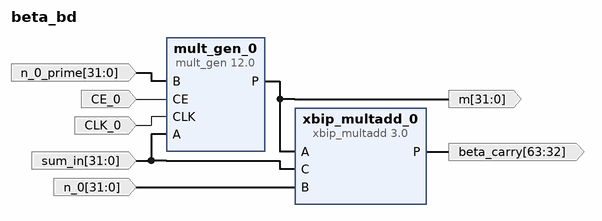
[diagram p0: block diagram of the top level]
# Vivado block design beta_bd, xc7z020clg400-1, Vivado 2024.1
create_bd_design beta_bd

create_bd_port -dir I -from 31 -to 0 -type data sum_in
create_bd_port -dir I -from 31 -to 0 -type data n_0_prime
create_bd_port -dir I -from 31 -to 0 -type data n_0
create_bd_port -dir O -from 63 -to 32 -type data beta_carry
create_bd_port -dir O -from 31 -to 0 -type data m
create_bd_port -dir I -type clk CLK_0
set_property -dict {CONFIG.FREQ_HZ 200000000} [get_bd_ports CLK_0]
create_bd_port -dir I -type ce CE_0
set_property -dict {CONFIG.POLARITY ACTIVE_HIGH} [get_bd_ports CE_0]

create_bd_cell -type ip -vlnv xilinx.com:ip:xbip_multadd:3.0 xbip_multadd_0
set_property -dict [list \
  CONFIG.c_a_type 1 \
  CONFIG.c_a_width 32 \
  CONFIG.c_ab_latency 0 \
  CONFIG.c_b_type 1 \
  CONFIG.c_b_width 32 \
  CONFIG.c_c_latency 0 \
  CONFIG.c_c_type 1 \
  CONFIG.c_c_width 32 \
  CONFIG.c_out_high 63 \
  CONFIG.c_out_low 32 \
] [get_bd_cells xbip_multadd_0]
create_bd_cell -type ip -vlnv xilinx.com:ip:mult_gen:12.0 mult_gen_0
set_property -dict [list \
  CONFIG.ClockEnable true \
  CONFIG.Multiplier_Construction Use_Mults \
  CONFIG.OutputWidthHigh 31 \
  CONFIG.PipeStages 1 \
  CONFIG.PortAType Unsigned \
  CONFIG.PortAWidth 32 \
  CONFIG.PortBType Unsigned \
  CONFIG.PortBWidth 32 \
  CONFIG.Use_Custom_Output_Width true \
] [get_bd_cells mult_gen_0]

# ---- connections ----

connect_bd_net -net B_0_1 [get_bd_ports n_0_prime] [get_bd_pins mult_gen_0/B]
connect_bd_net -net B_0_2 [get_bd_ports n_0] [get_bd_pins xbip_multadd_0/B]
connect_bd_net -net CE_0_1 [get_bd_ports CE_0] [get_bd_pins mult_gen_0/CE]
connect_bd_net -net CLK_0_1 [get_bd_ports CLK_0] [get_bd_pins mult_gen_0/CLK]
connect_bd_net [get_bd_pins mult_gen_0/P] [get_bd_ports m] [get_bd_pins xbip_multadd_0/A]
connect_bd_net [get_bd_ports sum_in] [get_bd_pins mult_gen_0/A] [get_bd_pins xbip_multadd_0/C]
connect_bd_net [get_bd_pins xbip_multadd_0/P] [get_bd_ports beta_carry]

validate_bd_design
save_bd_design
